# EAGLE design tps63020-buck-boost-flashlight-driver-17mm-mk-1.1.0 (EAGLE 9.2.2)
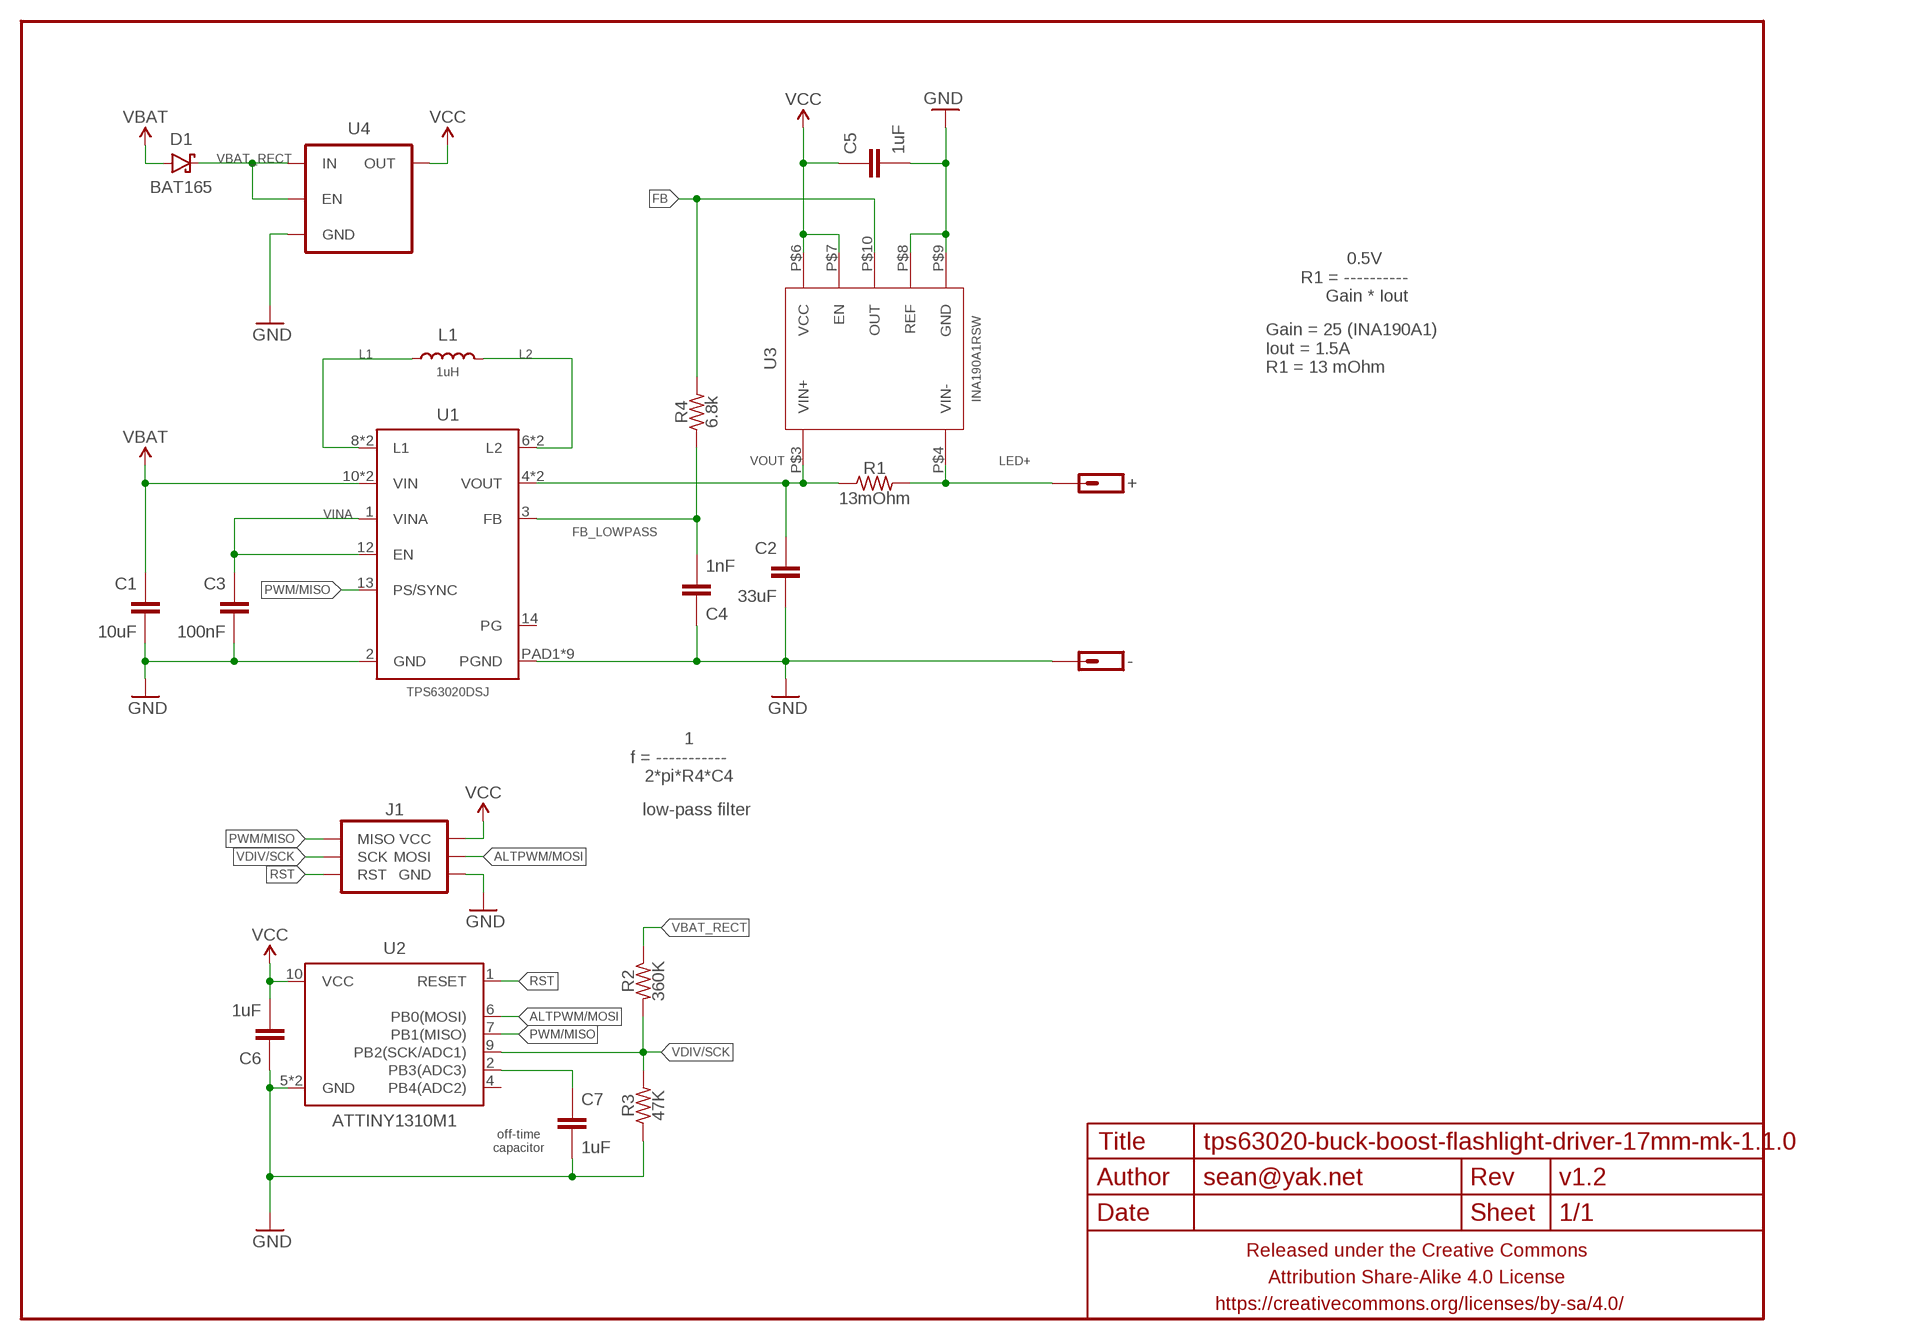
[diagram p0: schematic, sheet 1]

## Parts
+  M01SMD-1.6MMX3.2MM  [1X01-SMD-1.6MMX3.2MM]
-  M01SMD-1.6MMX3.2MM  [1X01-SMD-1.6MMX3.2MM]
C1  10uF  CAPACITOR-CERAMICC0805-TIGHTER  [C0805-TIGHTER]
C2  33uF  CAPACITOR-CERAMICC1206  [C1206]
C3  100nF  CAPACITOR-CERAMICC0402  [C0402]
C4  1nF  CAPACITOR-CERAMICC0402  [C0402]
C5  1uF  CAPACITOR-CERAMICC0402  [C0402]
C6  1uF  CAPACITOR-CERAMICC0402  [C0402]
C7  1uF  CAPACITOR-CERAMICC0402  [C0402]
D1  BAT165  DIODE-SCHOTTKYSOD323  [SOD323-SCHOTTKY]
FRAME1  FRAME-LETTERNO_PACKAGE  [DUMMY]
J1  AVR_SPI_PRG_6SMD-1.27MM  [2X3-1.27MM-SMD]
L1  1uH  INDUCTORXAL50X0  [XAL50X0]
R1  13mOhm  RESISTORR1206  [R1206]
R2  360K  RESISTORR0402  [R0402]
R3  47K  RESISTORR0402  [R0402]
R4  6.8k  RESISTORR0402  [R0402]
U1  TPS63020DSJ  [VSON-14-4MMX3MM]
U2  ATTINY1310M1  [QFN10(2X5)]
U3  INA190A1RSW  INA190RSW  [UQFN-10]
U4  V_REG_ENTLV700  [SC70]

## Nets
ALTPWM/MOSI: J1.4(MOSI) U2.6(PB0(MOSI))
FB: R4.2 U3.P$10(OUT)
FB_LOWPASS: C4.2 R4.1 U1.3(FB)
GND: -.P$1 C1.2 C2.2 C3.2 C4.1 C5.2 C6.1 C7.2 J1.6(GND) R3.1 U1.2(GND) U1.PAD1(PGND) U1.PAD2(PGND) U1.PAD3(PGND) U1.PAD4(PGND) U1.PAD5(PGND) U1.PAD6(PGND) U1.PAD7(PGND) U1.PAD8(PGND) U1.PADCENTER(PGND) U2.5(GND) U2.PAD(GND) U3.P$8(REF) U3.P$9(GND) U4.2(GND)
L1: L1.P$1 U1.8(L1) U1.9(L1)
L2: L1.P$2 U1.6(L2) U1.7(L2)
LED+: +.P$1 R1.2 U3.P$4(VIN-)
N$5: C7.1 U2.2(PB3(ADC3))
PWM/MISO: J1.1(MISO) U1.13(PS/SYNC) U2.7(PB1(MISO))
RST: J1.5(RST) U2.1(RESET)
VBAT: C1.1 D1.A U1.10(VIN) U1.11(VIN)
VBAT_RECT: D1.C R2.1 U4.1(IN) U4.3(EN)
VCC: C5.1 C6.2 J1.2(VCC) U2.10(VCC) U3.P$6(VCC) U3.P$7(EN) U4.5(OUT)
VDIV/SCK: J1.3(SCK) R2.2 R3.2 U2.9(PB2(SCK/ADC1))
VINA: C3.1 U1.1(VINA) U1.12(EN)
VOUT: C2.1 R1.1 U1.4(VOUT) U1.5(VOUT) U3.P$3(VIN+)
Unconnected: U1.14(PG) U2.4(PB4(ADC2))

## Notes on the sheet
- 0.5V
  R1 = ----------
       Gain * Iout
- Gain = 25 (INA190A1)
  Iout = 1.5A
  R1 = 13 mOhm
- 1
  f = -----------
      2*pi*R4*C4
- low-pass filter
- off-time
  capacitor

## Library data of the parts
+ - = a_parts:M01: Header 1 Standard 1-pin 0.1" header. Use with straight break away headers (SKU : PRT-00116), right angle break away headers (PRT-00553), swiss pins (PRT-00743), machine pins (PRT-00117), and female headers (PRT-00115).
C1-C7 = a_parts:CAPACITOR-CERAMIC: CAPACITOR, European symbol
D1 = a_parts:DIODE-SCHOTTKY: Schottky diodes in SFE's production catalog BAT20J 1A 23V 0.62Vf RB751 120mA 40V 0.37Vf PMEG4005EJ 0.5A 40V 0.42Vf MBRA140 1A 40V 0.5Vf B340A 3A 40V SMA
FRAME1 = a_parts:FRAME-LETTER: Schematic Frame Standard 8.5x11 US Letter frame; DESIGNER: sean@yak.net; VERSION: v1.2
J1 = a_parts:AVR_SPI_PRG_6: AVR ISP 6 Pin This is the reduced ISP connector for AVR programming. Common on Arduino. This footprint will take up less PCB space and can be used with a 10-pin to 6-pin adapter such as SKU: BOB-08508 **Special note about "TEST_POINT" package. The stop mask is on the top side, so if you want your programming test points to be on the bottom of your board, make sure to place this package on the bottom side of the board. This also ensure that the orientation to program from the bottom side will be correct.
L1 = a_parts:INDUCTOR: Inductors Basic Inductor/Choke - 0603 and 1206. Footprints are not proven and vary greatly between part numbers. SRN6045- 33uH, 20% 1.4A SDR0403-560KL - 56uH, 10%, 500mA RMS/740mA peak
R1-R4 = a_parts:RESISTOR: RESISTOR, American symbol
U1 = a_parts:TPS63020
U2 = a_parts:ATTINY13: Atmel 8-pin 1kB flash uC
U3 = a_parts:INA190
U4 = a_parts:V_REG_EN

## Board
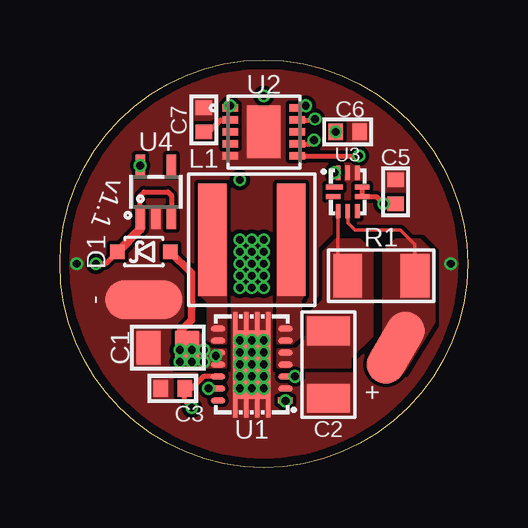
[diagram p1: board, top side]
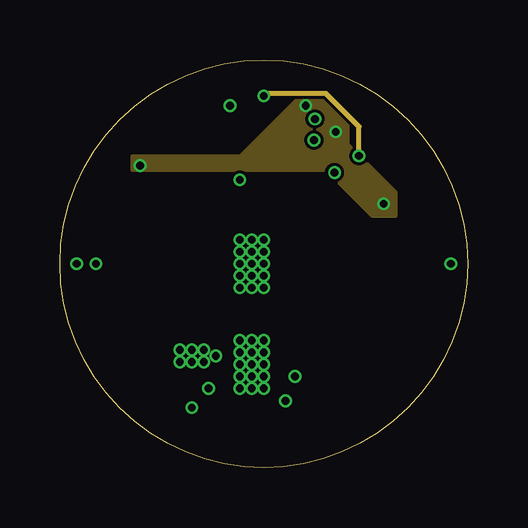
[diagram p2: board, inner layer Route2]
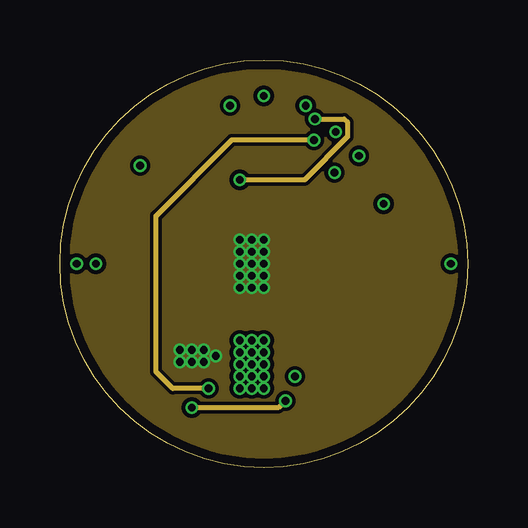
[diagram p3: board, inner layer Route15]
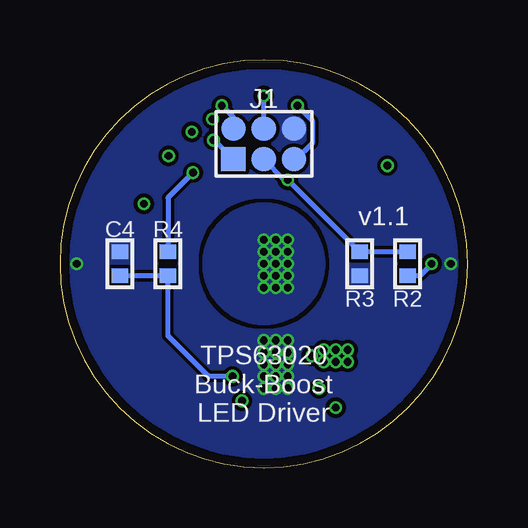
[diagram p4: board, bottom side, seen from below]

Size 17 x 17 mm. Coordinates in mm from the lower left corner, seen from the top.
Outline: 0,8.5 arc-180 17,8.5 arc-180 0,8.5
Copper layers (1*2*15*16): Top 0.035559375mm / dielectric 0.17018125mm / Route2 0.01778125mm / dielectric 47mil / Route15 0.01778125mm / dielectric 0.17018125mm / Bottom 0.035559375mm
Design rules "oshpark-4layer *": minimum track width 5mil, minimum drill 10mil, track to track 5mil, track to pad 5mil, pad to pad 5mil, via to via 5mil, smd to smd 0mil, copper to edge 15mil, drill to drill 6mil, minimum pad ring 4mil, minimum via ring 4mil, stop-mask expansion 2.5mil, vias tented up to drill 0.5mm, thermal gap 10mil

### Footprints (pad centres in the part's own frame; a part is rotated, then mirrored left to right if it is on the bottom)
1X01-SMD-1.6MMX3.2MM = smd 1.6 x 3.2: P$1 0,0
C0805-TIGHTER = smd 1 x 1.4: 1 -0.8,0; 2 0.8,0
C1206 = smd 1.2 x 1.8: 1 -1.4,0; 2 1.4,0
C0402 = smd 0.6 x 0.7: 1 -0.5,0; 2 0.5,0
SOD323-SCHOTTKY = smd 0.6 x 0.6: A -1.1,0; C 1.1,0
2X3-1.27MM-SMD = smd 1.016 x 1.016: 1 -1.27,-0.635; 2 -1.27,0.635; 3 0,-0.635; 4 0,0.635; 5 1.27,-0.635; 6 1.27,0.635
XAL50X0 = smd 1.18 x 4.7: P$1 -1.651,0; P$2 1.651,0
R1206 = smd 1.2 x 1.8: 1 -1.4,0; 2 1.4,0
R0402 = smd 0.6 x 0.7: 1 -0.5,0; 2 0.5,0
VSON-14-4MMX3MM = smd 0.24 x 0.6: 1 -1.5,-1.4; 2 -1,-1.4; 3 -0.5,-1.4; 4 0,-1.4; 5 0.5,-1.4; 6 1,-1.4; 7 1.5,-1.4; 8 1.5,1.4; 9 1,1.4; 10 0.5,1.4; 11 0,1.4; 12 -0.5,1.4; 13 -1,1.4; 14 -1.5,1.4 | smd 0.775 x 0.2: PAD1 -1.812,0.69; PAD2 -1.812,0.23; PAD3 -1.812,-0.23; PAD4 -1.812,-0.69; PAD5 1.812,-0.69; PAD6 1.812,-0.23; PAD7 1.812,0.23; PAD8 1.812,0.69 | smd 2.85 x 1.58: PADCENTER 0,0
QFN10(2X5) = smd 0.65 x 0.3: 1 -1.4,1; 2 -1.4,0.5; 3 -1.4,0; 4 -1.4,-0.5; 5 -1.4,-1; 6 1.4,-1; 7 1.4,-0.5; 8 1.4,0; 9 1.4,0.5; 10 1.4,1 | smd 1.4 x 2.2: PAD 0,0
UQFN-10 = smd 0.2 x 0.7: P$1 -0.2,-0.55 | smd 0.2 x 0.6: P$2 0.2,-0.6; P$6 0.2,0.6; P$7 -0.2,0.6 | smd 0.6 x 0.2: P$3 0.8,-0.4; P$4 0.8,0; P$5 0.8,0.4; P$8 -0.8,0.4; P$9 -0.8,0; P$10 -0.8,-0.4
SC70 = smd 0.4 x 0.9: 1 -0.65,-1.1; 2 0,-1.1; 3 0.65,-1.1; 4 0.65,1.1; 5 -0.65,1.1

### Placement (x,y rotation side)
+  14,5 330 top
-  3.5,7 90 top
C1  4.5,5 180 top
C2  11.2,4.3 270 top
C3  4.7,3.3 180 top
C4  14.5,8.5 270 bottom
C5  14,11.5 90 top
C6  12,14 180 top
C7  6,14.5 90 top
D1  3.5,9 180 top
FRAME1  -0.5,-0.5 0 top
J1  8.5,13.5 0 bottom
L1  8,9.5 0 top
R1  13.4,8 0 top
R2  2.5,8.5 90 bottom
R3  4.5,8.5 90 bottom
R4  12.5,8.5 90 bottom
U1  8,4.3 90 top
U2  8.5,14 0 top
U3  12,11.5 270 top
U4  4,11.5 0 top

### Tracks (layer width: path | path; a pad name or v marks a point on that pad's centre or on a via)
ALTPWM/MOSI  (via drill 0.33)
  Top 0.2: U2.6 v12.47,13
  Route2 0.2: v12.47,13 12.47,14.23 11.1,15.6 8.6,15.6 v8.5,15.5
  Bottom 0.2: J1.4 v8.5,15.5
FB  (via drill 0.33)
  Top 0.2: U3.P$10 v11.46,12.3
  Bottom 0.2: v11.46,12.3 12.5,11.26 R4.2
FB_LOWPASS  (via drill 0.33)
  Top 0.2: U1.3 v9.81,3.8
  Bottom 0.2: v9.81,3.8 10.8,3.8 12.5,5.5 R4.1 C4.2
GND  (via drill 0.33)
  other vias: 8,4.3 7.5,4.3 8.5,4.3 8.5,4.8 8,4.8 7.5,4.8 7.5,5.3 8,5.3 8.5,5.3 7.5,3.8 8,3.8 8.5,3.8 8.5,3.3 8,3.3 7.5,3.3 0.7,8.5 16.3,8.5
  pour Bottom (isolate 0.152, rank 6, no thermals): 8.5,0 arc-90 0,8.5 arc-90 8.5,17 arc-90 17,8.5 arc-90
  pour Top (isolate 0.152, rank 6, no thermals): 8.5,0 arc-90 0,8.5 arc-90 8.5,17 arc-90 17,8.5 arc-90
L1
  pour Top (rank 2, no thermals): 6.9,5.2 6.3,5.2 6.2,5.3 6.2,6.9 5.9,7.2 5.9,11.7 6.9,11.7
L2
  pour Top (rank 2, no thermals): 9.1,5.2 9.7,5.2 10,5.5 10,6.5 10,7 10.1,7.1 10.1,11.7 9.2,11.7 9.1,11.7
LED+
  Top 0.152: U3.P$4 12,10.2 12.3,9.9 14.2,9.9 14.8,9.3 R1.2
  pour Top (rank 3, no thermals): 13,4.5 13.5,5 13.5,9 14,9.5 15,9.5 15.6,8.9 15.6,6.1 14.3,4 13,4
N$5
  Top 0.2: C7.1 6.2,14 6.7,14.5 U2.2
PWM/MISO  (via drill 0.33)
  Top 0.2: U1.13 v6.19,3.3 | U2.7 10.43,13.5 v10.59,13.66
  Route15 0.2: v6.19,3.3 4.7,3.3 4,4 4,10.5 7.16,13.66 v10.59,13.66
  Bottom 0.2: J1.1 10.56,13.66 v10.59,13.66
RST  (via drill 0.33)
  Top 0.2: U2.1 v7.1,15.1
  Bottom 0.2: v7.1,15.1 v7.09,15.1 6.47,14.47 6.47,13.53 7.13,12.87 J1.5
VBAT  (via drill 0.33)
  Top 0.305: v5,4.9 5,5.67 5.48,6.15 5.48,8.12 D1.A
  other vias: 5,4.4 5.5,4.4 6,4.4 6.5,4.65 5.5,4.9 6,4.9 7.5,9 8,9 8.5,9 8.5,8.5 8,8.5 7.5,8.5 7.5,8 8,8 8.5,8 7.5,7.5 8,7.5 8.5,7.5 7.5,9.5 8,9.5 8.5,9.5
  pour Bottom (isolate 0.152, no thermals): 6,8.5 arc-180 11,8.5 arc-180
  pour Route15 (isolate 0.152, rank 6, no thermals): 8.5,0 arc-90 0,8.5 arc-90 8.5,17 arc-90 17,8.5 arc-90
  pour Top (rank 3, no thermals): 6.9,4.9 6.5,4.9 5.8,5.6 4.9,5.6 4.9,4.2 6.9,4.2
VBAT_RECT  (via drill 0.33)
  Top 0.2: D1.C 1.9,8.5 v1.5,8.5 | U4.1 3.35,11.35 3.5,11.5 4.5,11.5 4.65,11.35 U4.3
  Top 0.4: D1.C 3.35,9.95 U4.1
  Bottom 0.2: v1.5,8.5 2,8 R2.1
VCC  (via drill 0.33)
  Top 0.2: U3.P$7 U3.P$6 13.2,11.3 v13.5,11 C5.1 | U2.10 10.15,15 v10.25,15.1
  Bottom 0.2: J1.2 9.77,14.62 v10.25,15.1
  other vias: 3.35,12.6 11.5,14
  pour Route2 (rank 3, no thermals): 3,12.4 11.1,12.4 13,10.5 14,10.5 14,11.5 12,13.5 12,14.5 11,15.5 10,15.5 7.5,13 3,13
VDIV/SCK  (via drill 0.33)
  Top 0.2: U2.9 10.6,14.5 v10.64,14.54
  Route15 0.2: v10.64,14.54 11.86,14.54 12,14.4 11.99,14.39 11.99,13.8 10.2,12 v7.5,12
  Bottom 0.2: R2.2 R3.2 v7.5,12 7.63,12 J1.3
VINA  (via drill 0.33)
  Top 0.2: U1.12 5.99,3.79 5.5,3.3 C3.1 5.2,2.8 v5.5,2.5 | U1.1 v9.4,2.79
  Route15 0.2: v9.4,2.79 9.11,2.5 v5.5,2.5
VOUT
  Top 0.152: U3.P$3 11.6,8.4 R1.1
  pour Top (rank 3, no thermals): 9.1,4.9 9.1,4.2 12.1,4.2 12.1,4.6 13,5.5 13,9 12.5,9.5 11.5,9.5 11,9 11,7 10.3,6.3 10.3,5.5 9.7,4.9

### Text on the board
bPlace: TPS63020 / Buck-Boost / LED Driver